# EAGLE design RoverPCB_version_4.2 (EAGLE 9.6.2)

## Sheet 1 of 2
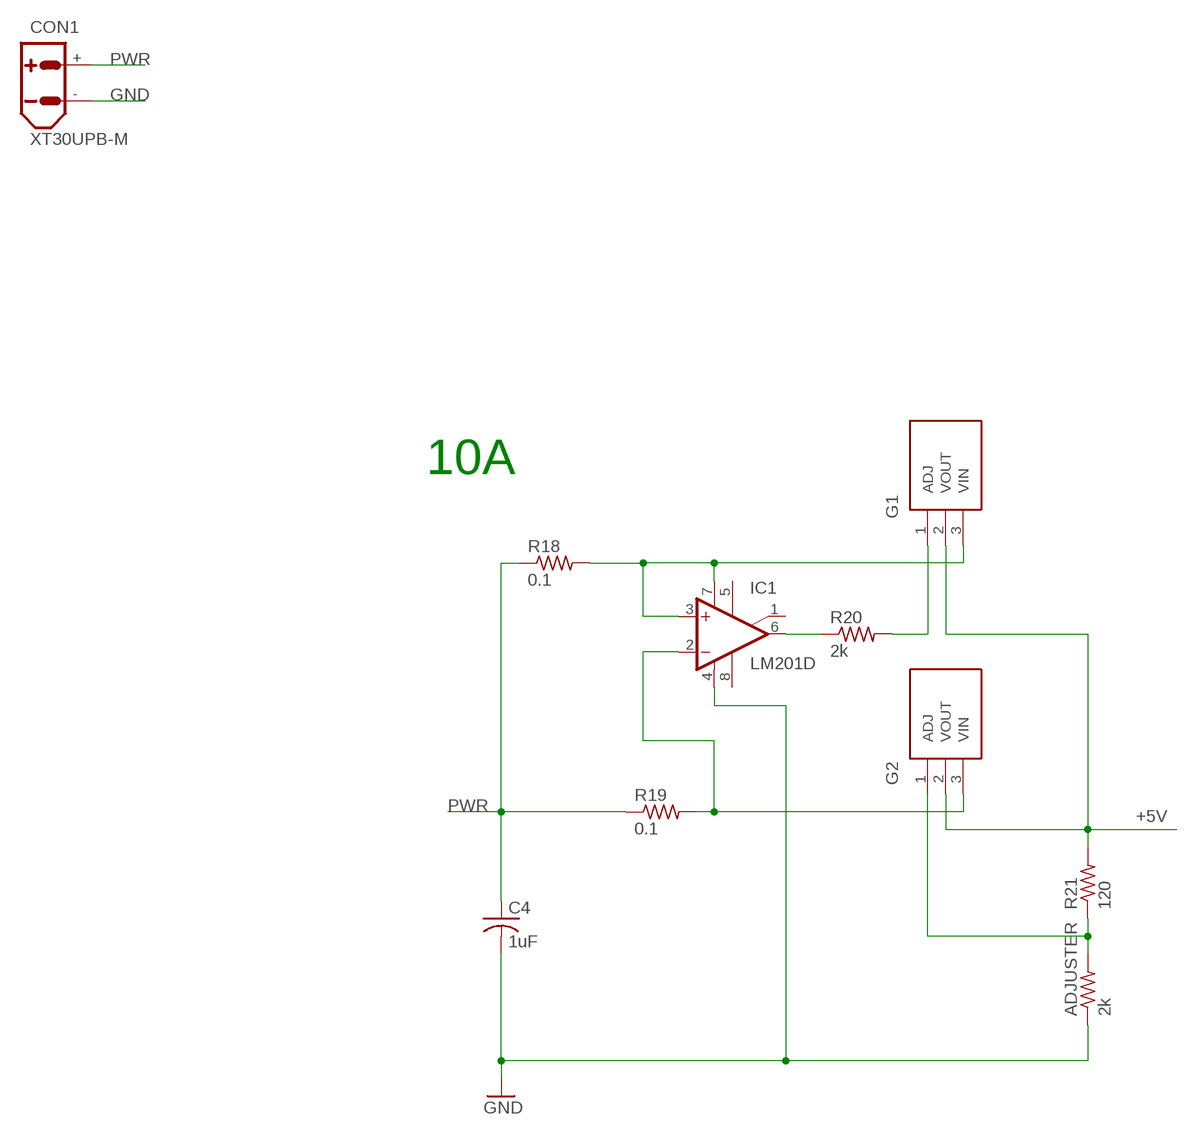
[diagram p0: schematic, sheet 1]

### Parts
ADJUSTER  2k  R-US_0204/5  [0204/5]
C4  1uF  C-USC0402K  [C0402K]
CON1  XT30UPB-M  [XT30UPB-M]
IC1  LM201D  [SO08]
IC11  G1  LM338T_NOPB  [TO254P470X1028X1955-3P]
IC12  G2  LM338T_NOPB  [TO254P470X1028X1955-3P]
R18  0.1  R-US_M1206  [M1206]
R19  0.1  R-US_M1206  [M1206]
R20  2k  R-US_R0805  [R0805]
R21  120  R-US_R0805  [R0805]

### Nets
+5V: IC11.2(VOUT) IC12.2(VOUT) R21.2 ; also sheet 2
GND: ADJUSTER.1 C4.2 CON1.- IC1.4(V-) ; also sheet 2
N$2: IC11.1(ADJ) R20.2
N$3: IC1.6(OUT) R20.1
N$4: ADJUSTER.2 IC12.1(ADJ) R21.1
N$20: IC1.3(+IN) IC1.7(V+) IC11.3(VIN) R18.2
N$23: IC1.2(-IN) IC12.3(VIN) R19.2
PWR: C4.1 CON1.+ R18.1 R19.1 ; also sheet 2
Unconnected: IC1.1(ON/CMP) IC1.5(ON) IC1.8(CMP)

### Notes on the sheet
- 10A

## Sheet 2 of 2
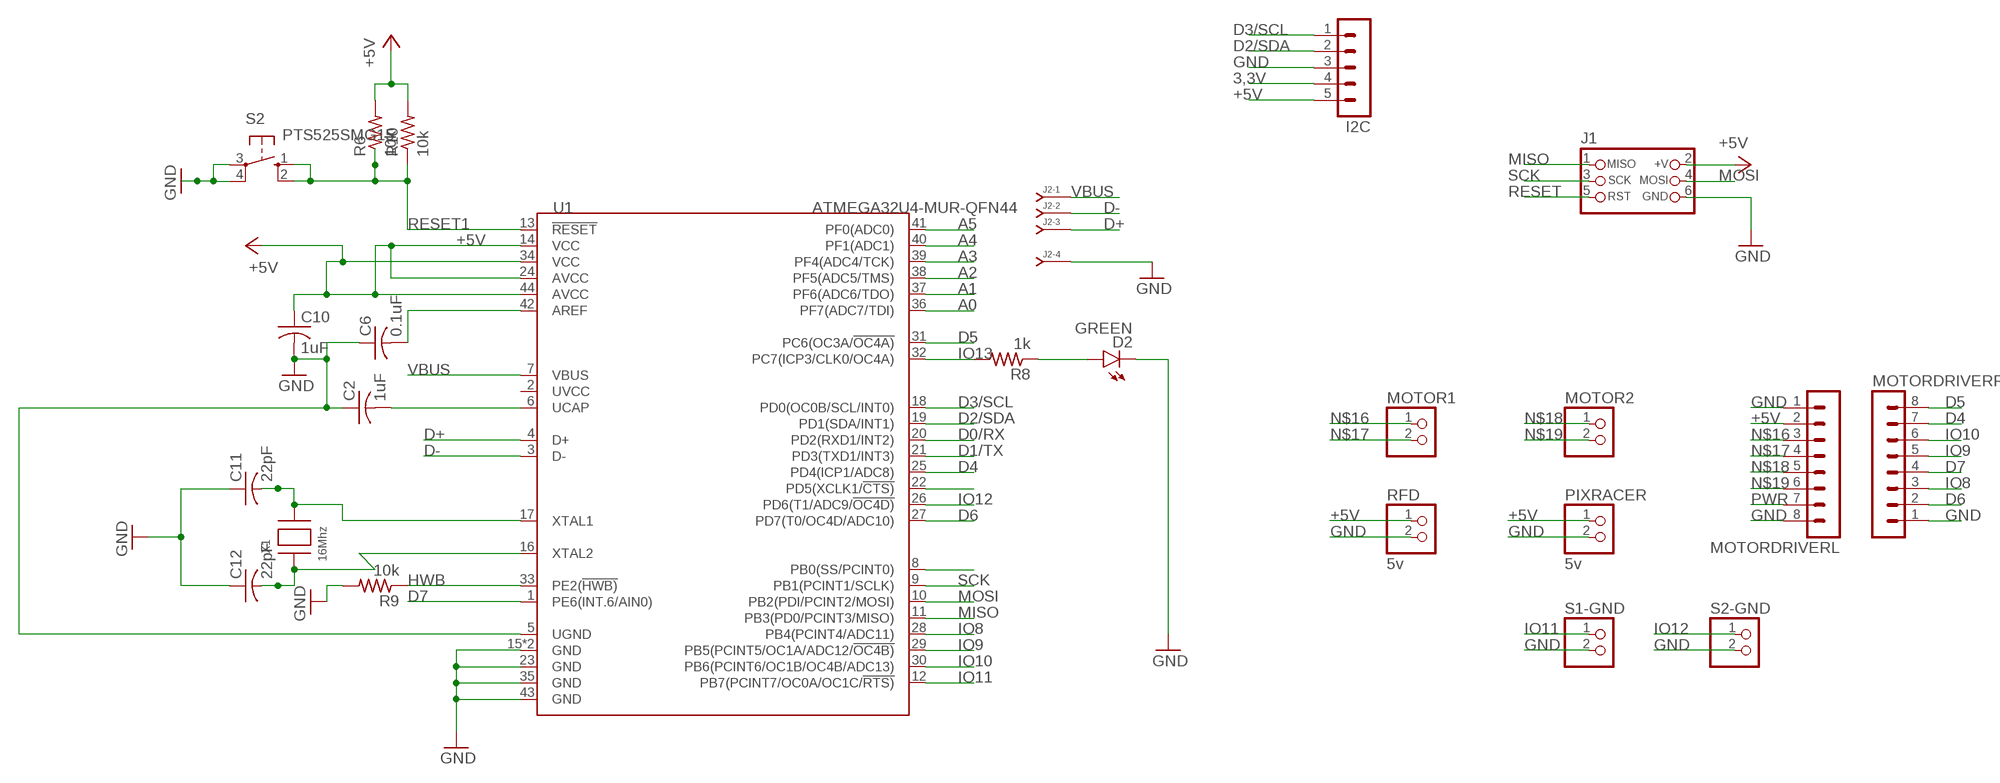
[diagram p1: schematic, sheet 2]

### Parts
C2  1uF  C-USC0805  [C0805]
C6  0.1uF  C-USC0805  [C0805]
C10  1uF  C-USC0805  [C0805]
C11  22pF  C-USC0805  [C0805]
C12  22pF  C-USC0805  [C0805]
D2  GREEN  LED-GREEN0603  [LED-0603]
I2C  MA05-1  [MA05-1]
J1  CON_HEADER_PRG_AVR_ICSP-PTH  [HEADER_PRG_2X03]
J2  J-04-SIP-100  [SIP-100-04]
MOTOR1  PINHD-1X2  [1X02]
MOTOR2  PINHD-1X2  [1X02]
MOTORDRIVERL  MA08-1  [MA08-1]
MOTORDRIVERR  MA08-1  [MA08-1]
PIXRACER  5v  PINHD-1X2  [1X02]
R6  10k  R-US_R0805  [R0805]
R8  1k  R-US_R0805  [R0805]
R9  10k  R-US_R0805  [R0805]
R10  10k  R-US_R0805  [R0805]
RFD  5v  PINHD-1X2  [1X02]
S1-GND  PINHD-1X2  [1X02]
S2  PTS525SMG15  [SMG15]
S2-GND  PINHD-1X2  [1X02]
U1  ATMEGA32U4-MUR-QFN44  MCU-ATMEGA32U4-MUR(VQFN44)  [QFN44G-0.5-7X7MM]
X1  16Mhz  XTALNX5032  [NX5032]

### Nets
3,3V: I2C.4
+5V: C10.1 I2C.5 J1.2(+V) MOTORDRIVERL.2 PIXRACER.1 R6.2 R10.2 RFD.1 U1.14(VCC) U1.24(AVCC) U1.34(VCC) U1.44(AVCC) ; also sheet 1
A0: U1.36(PF7(ADC7/TDI))
A1: U1.37(PF6(ADC6/TDO))
A2: U1.38(PF5(ADC5/TMS))
A3: U1.39(PF4(ADC4/TCK))
A4: U1.40(PF1(ADC1))
A5: U1.41(PF0(ADC0))
D0/RX: U1.20(PD2(RXD1/INT2))
D1/TX: U1.21(PD3(TXD1/INT3))
D2/SDA: I2C.2 U1.19(PD1(SDA/INT1))
D3/SCL: I2C.1 U1.18(PD0(OC0B/SCL/INT0))
D4: MOTORDRIVERR.7 U1.25(PD4(ICP1/ADC8))
D5: MOTORDRIVERR.8 U1.31(PC6(OC3A/!OC4A))
D6: MOTORDRIVERR.2 U1.27(PD7(T0/OC4D/ADC10))
D7: MOTORDRIVERR.4 U1.1(PE6(INT.6/AIN0))
D+: J2.3 U1.4(D+)
D-: J2.2 U1.3(D-)
GND: C2.1 C6.1 C10.2 C11.1 C12.1 D2.C I2C.3 J1.6(GND) J2.4 MOTORDRIVERL.1 MOTORDRIVERL.8 MOTORDRIVERR.1 PIXRACER.2 R9.2 RFD.2 S1-GND.2 S2-GND.2 S2.3(P) S2.4(P) U1.5(UGND) U1.15(GND) U1.23(GND) U1.35(GND) U1.43(GND) U1.TAB(GND) ; also sheet 1
HWB: R9.1 U1.33(PE2(!HWB))
IO8: MOTORDRIVERR.3 U1.28(PB4(PCINT4/ADC11))
IO9: MOTORDRIVERR.5 U1.29(PB5(PCINT5/OC1A/ADC12/!OC4B))
IO10: MOTORDRIVERR.6 U1.30(PB6(PCINT6/OC1B/OC4B/ADC13))
IO11: S1-GND.1 U1.12(PB7(PCINT7/OC0A/OC1C/!RTS))
IO12: S2-GND.1 U1.26(PD6(T1/ADC9/!OC4D))
IO13: R8.2 U1.32(PC7(ICP3/CLK0/OC4A))
MISO: J1.1(MISO) U1.11(PB3(PD0/PCINT3/MISO))
MOSI: J1.4(MOSI) U1.10(PB2(PDI/PCINT2/MOSI))
N$1: D2.A R8.1
N$6: C11.2 U1.17(XTAL1) X1.P$2
N$8: C2.2 U1.6(UCAP)
N$9: C12.2 U1.16(XTAL2) X1.P$1
N$10: C6.2 U1.42(AREF)
N$16: MOTOR1.1 MOTORDRIVERL.3
N$17: MOTOR1.2 MOTORDRIVERL.4
N$18: MOTOR2.1 MOTORDRIVERL.5
N$19: MOTOR2.2 MOTORDRIVERL.6
N$21: U1.22(PD5(XCLK1/!CTS))
N$24: U1.8(PB0(SS/PCINT0))
PWR: MOTORDRIVERL.7 ; also sheet 1
RESET: J1.5(RST)
RESET1: R6.1 R10.1 S2.1(S) S2.2(S) U1.13(!RESET)
SCK: J1.3(SCK) U1.9(PB1(PCINT1/SCLK))
VBUS: J2.1 U1.7(VBUS)
Unconnected: S2.S1(S) S2.S2(S) U1.2(UVCC)

## Library data of the parts
ADJUSTER R6 R10 R18-R21 = adafruit:R-US_: RESISTOR, American symbol
C2 C4 C6 C10-C12 = adafruit:C-US: CAPACITOR, American symbol
CON1 = amass:XT30: AMASS XT30 connector Store in Japan AMASS XT30 connector <https://szc.jp/ams-xt30>
D2 = SparkFun-LED:LED-GREEN: Various green LEDs Green LEDs used in SFE Production 0603- DIO-00821 LARGE- DIO-00862 LILYPAD- DIO-09910; PROD_ID: DIO-00821
I2C = con-lstb:MA05-1: PIN HEADER; OC_FARNELL: unknown; OC_NEWARK: unknown
IC1 = linear:LM201: OP AMP
IC11 IC12 = LM338T_NOPB:LM338T_NOPB: 5 Amp Adjustable Regulator LM338T LM338T/NOPB, Voltage Regulator, 5A Adjustable 1.2 32 V, 25W, 3-Pin TO-220 Source: Datasheet <http://www.ti.com/lit/ds/symlink/lm338.pdf>; ARROW_PART_NUMBER: LM338T/NOPB; ARROW_PRICE-STOCK: https://www.arrow.com/en/products/lm338tnopb/texas-instruments; DESCRIPTION: 5 Amp Adjustable Regulator LM338T LM338T/NOPB, Voltage Regulator, 5A Adjustable 1.2 32 V, 25W, 3-Pin TO-220; HEIGHT: 4.7mm; MANUFACTURER_NAME: Texas Instruments; MANUFACTURER_PART_NUMBER: LM338T/NOPB; MOUSER_PART_NUMBER: 926-LM338T/NOPB; MOUSER_PRICE-STOCK: https://www.mouser.co.uk/ProductDetail/Texas-Instruments/LM338T-NOPB?qs=X1J7HmVL2ZENaH7%2FMvkSlw%3D%3D
J1 = dp_devices:CON_HEADER_PRG_AVR_ICSP: 2x3 AVR ICSP programming header
J2 = con-headers-jp:J-04-: HEADER JACK PINS
MOTOR1 MOTOR2 S1-GND S2-GND = pinhead:PINHD-1X2: PIN HEADER
MOTORDRIVERL MOTORDRIVERR = con-lstb:MA08-1: PIN HEADER; OC_FARNELL: unknown; OC_NEWARK: unknown
PIXRACER RFD = pinhead:PINHD-1X2: PIN HEADER; SPICEPREFIX: R
R8 R9 = adafruit:R-US_: RESISTOR, American symbol; SPICEPREFIX: R
S2 = pts525_20:PTS525*G15: PTS 525 Series Miniature Tact Switch for SMD Source: http://www.ck-components.com/14407/pts525_8sept14.pdf/; MF: C&K Components; MPN: PTS525SMG15SMTR2LFS; OC_FARNELL: unknown; OC_NEWARK: unknown
U1 = Seeed-IC-2016:MCU-ATMEGA32U4-MUR(VQFN44): 310010016; MPN: ATMEGA32U4-MUR
X1 = adafruit:XTAL: Low cost SMT crystals, no capacitors included http://www.ladyada.net/library/eagle

## Board
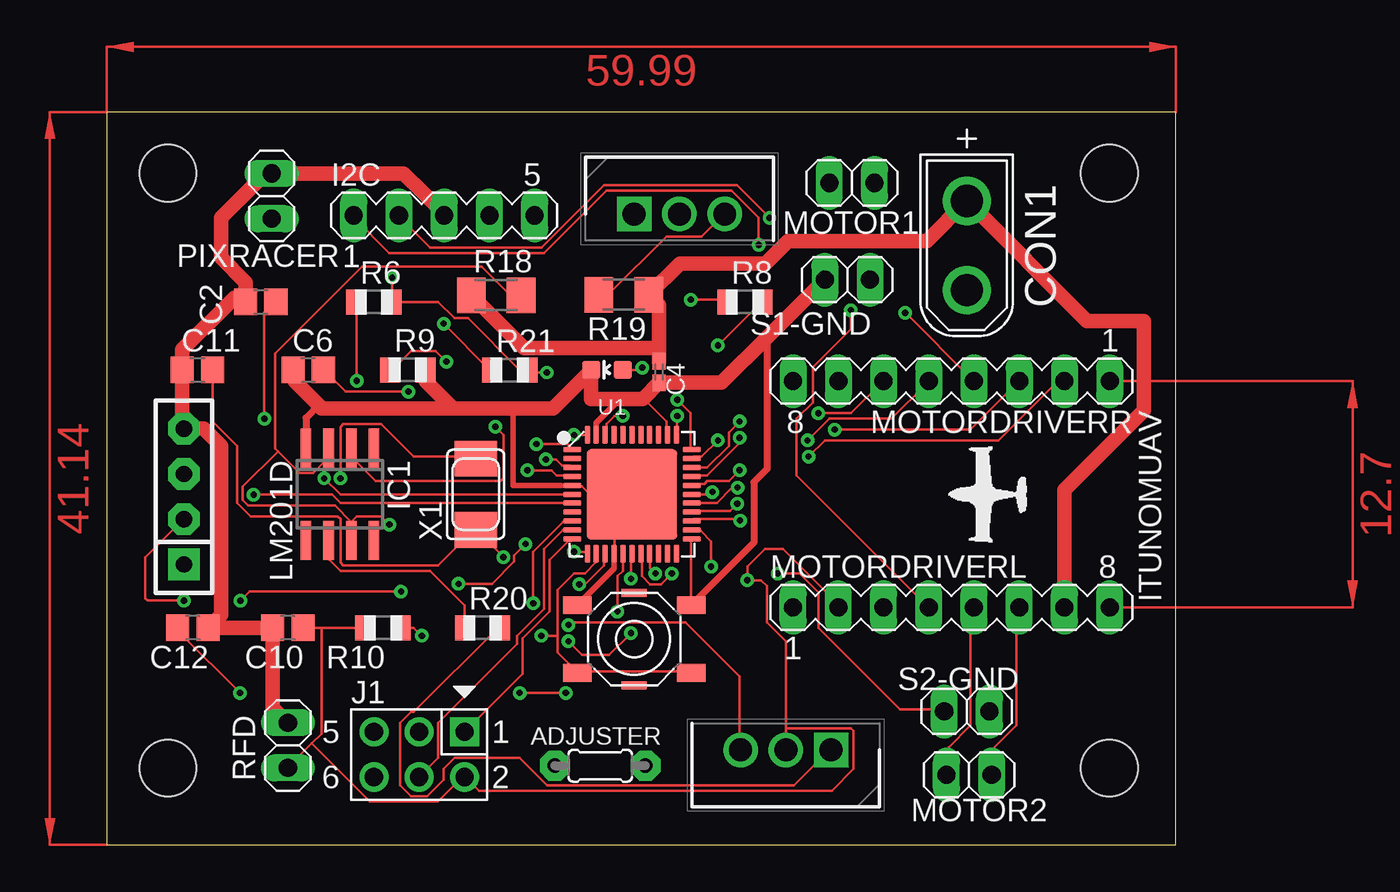
[diagram p2: board, top side]
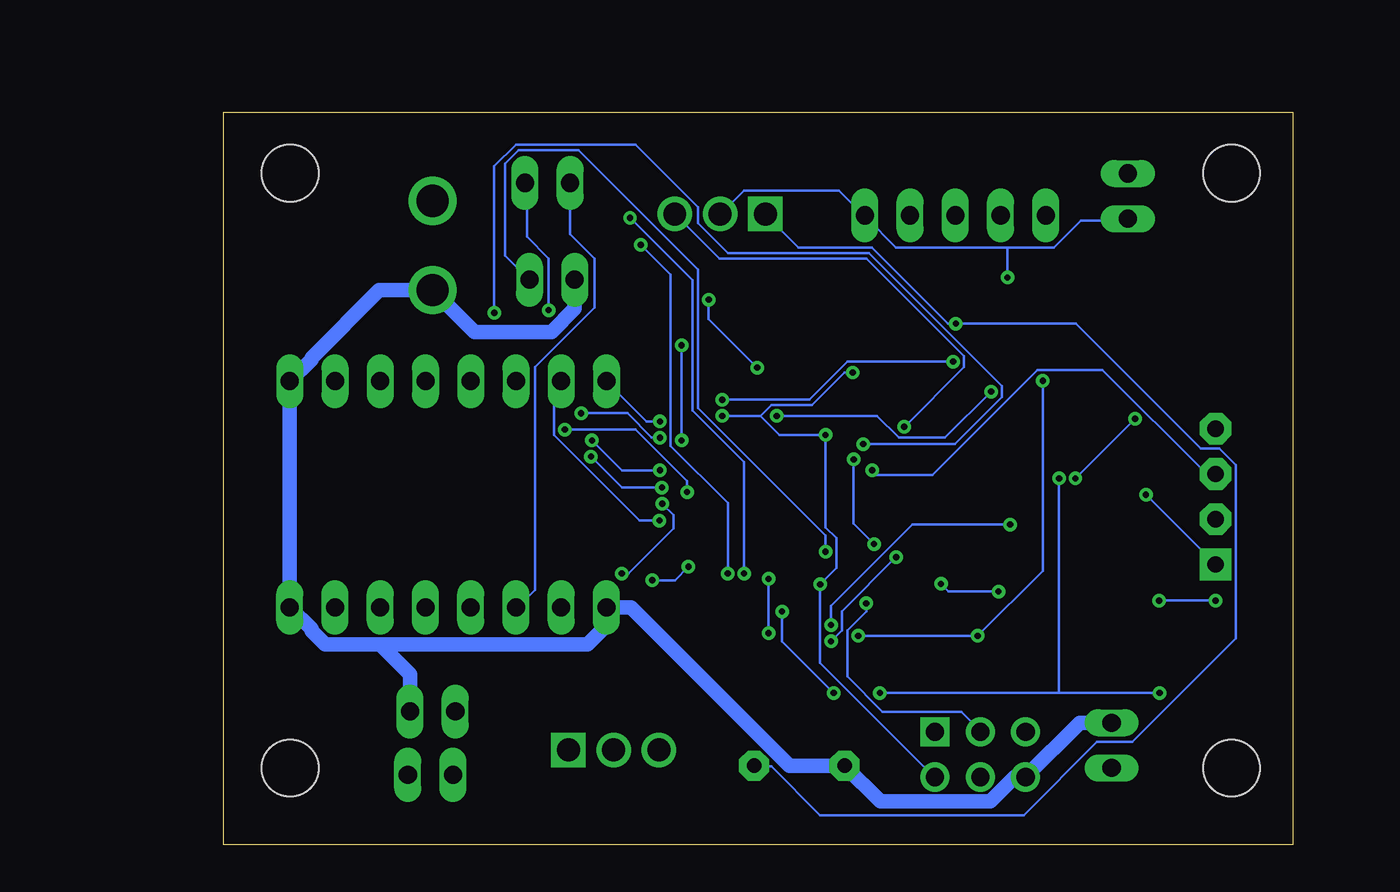
[diagram p3: board, bottom side, seen from below]

Size 59.99 x 41.14 mm. Coordinates in mm from the lower left corner, seen from the top.
Outline: 0,0 59.99,0 59.99,41.14 0,41.14 0,0
Copper layers (1*16): Top 0.035mm / dielectric 1.5mm / Bottom 0.035mm
Design rules "default": minimum track width 6mil, minimum drill 0.35mm, track to track 6mil, track to pad 6mil, pad to pad 6mil, via to via 6mil, smd to smd 6mil, copper to edge 40mil, drill to drill 6mil, minimum pad ring 10mil, minimum via ring 8mil, stop-mask expansion 4mil, vias tented up to drill 0mil, thermal gap 10mil
Holes 3.2 mm at 3.43,37.72 3.43,4.32 56.26,4.32 56.26,37.72

### Footprints (pad centres in the part's own frame; a part is rotated, then mirrored left to right if it is on the bottom)
0204/5 = drill 0.813 pad 1.676 octagon: 1 -2.54,0; 2 2.54,0
C0805 = smd 1.3 x 1.5: 1 -0.85,0; 2 0.85,0
C0402K = smd 0.925 x 0.74: 1 -0.6,0; 2 0.6,0
XT30UPB-M = drill 1.8: + 2.5,0; - -2.5,0
LED-0603 = smd 1 x 1: A 0,-0.877; C 0,0.877
MA05-1 = drill 1.016 long: 1 -5.08,0; 2 -2.54,0; 3 0,0; 4 2.54,0; 5 5.08,0
SO08 = smd 0.6 x 2.2: 1 -1.905,-2.6; 2 -0.635,-2.6; 3 0.635,-2.6; 4 1.905,-2.6; 5 1.905,2.6; 6 0.635,2.6; 7 -0.635,2.6; 8 -1.905,2.6
TO254P470X1028X1955-3P = drill 1.29 pad 1.935 square: 1 0,0 | drill 1.29 pad 1.935: 2 2.54,0; 3 5.08,0
HEADER_PRG_2X03 = drill 1.02 pad 1.632 square: 1 -2.54,-1.27 | drill 1.02 pad 1.632: 2 -2.54,1.27; 3 0,-1.27; 4 0,1.27; 5 2.54,-1.27; 6 2.54,1.27
SIP-100-04 = drill 0.914 pad 1.778 square: 1 -3.81,0 | drill 0.914 pad 1.778 octagon: 2 -1.27,0; 3 1.27,0; 4 3.81,0
1X02 = drill 1.016 long: 1 -1.27,0; 2 1.27,0
MA08-1 = drill 1.016 long: 1 -8.89,0; 2 -6.35,0; 3 -3.81,0; 4 -1.27,0; 5 1.27,0; 6 3.81,0; 7 6.35,0; 8 8.89,0
R0805 = smd 1.1 x 1.4: 1 -1,0; 2 1,0
M1206 = smd 1.6 x 2: 1 -1.4,0; 2 1.4,0
SMG15 = smd 1.6 x 1: 1 -3.2,1.9; 2 3.2,1.9; 3 -3.2,-1.9; 4 3.2,-1.9 | smd 1.4 x 0.45: S1 0,2.6; S2 0,-2.6
QFN44G-0.5-7X7MM = smd 1 x 0.3: 1 -3.35,2.5; 2 -3.35,2; 3 -3.35,1.5; 4 -3.35,1; 5 -3.35,0.5; 6 -3.35,0; 7 -3.35,-0.5; 8 -3.35,-1; 9 -3.35,-1.5; 10 -3.35,-2; 11 -3.35,-2.5; 23 3.35,-2.5; 24 3.35,-2; 25 3.35,-1.5; 26 3.35,-1; 27 3.35,-0.5; 28 3.35,0; 29 3.35,0.5; 30 3.35,1; 31 3.35,1.5; 32 3.35,2; 33 3.35,2.5 | smd 0.3 x 1: 12 -2.5,-3.35; 13 -2,-3.35; 14 -1.5,-3.35; 15 -1,-3.35; 16 -0.5,-3.35; 17 0,-3.35; 18 0.5,-3.35; 19 1,-3.35; 20 1.5,-3.35; 21 2,-3.35; 22 2.5,-3.35; 34 2.5,3.35; 35 2,3.35; 36 1.5,3.35; 37 1,3.35; 38 0.5,3.35; 39 0,3.35; 40 -0.5,3.35; 41 -1,3.35; 42 -1.5,3.35; 43 -2,3.35; 44 -2.5,3.35 | smd 5.08 x 5.08: TAB 0,0
NX5032 = smd 2 x 2.4: P$1 2,0; P$2 -2,0

### Placement (x,y rotation side)
ADJUSTER  27.69,4.45 0 top
C2  8.64,30.48 0 top
C4  30.99,26.54 270 top
C6  11.3,26.67 0 top
C10  10.16,12.19 180 top
C11  5.08,26.67 0 top
C12  4.83,12.19 180 top
CON1  48.26,33.66 90 top
D2  28.07,26.67 90 top
I2C  18.93,35.34 0 top
IC1  13.08,19.68 180 top
IC11  40.64,5.33 180 top
IC12  29.59,35.41 0 top
J1  17.53,5.08 180 top
J2  4.32,19.56 90 top
MOTOR1  41.81,37.16 0 top
MOTOR2  48.39,3.94 0 top
MOTORDRIVERL  47.4,13.34 0 top
MOTORDRIVERR  47.4,26.04 180 top
PIXRACER  9.25,36.42 90 top
R6  14.99,30.48 0 top
R8  35.81,30.48 0 top
R9  16.89,26.67 0 top
R10  15.49,12.19 180 top
R18  21.84,30.86 0 top
R19  29.01,30.89 180 top
R20  21.08,12.19 0 top
R21  22.61,26.64 0 top
RFD  10.16,5.59 90 top
S1-GND  41.56,31.73 180 top
S2  29.59,11.56 180 top
S2-GND  48.26,7.49 0 top
U1  29.46,19.68 0 top
X1  20.7,19.68 90 top

### Tracks (layer width: path | path; a pad name or v marks a point on that pad's centre or on a via)
+5V  (via drill 0.35)
  Top 0.152: 16,30.48 18.59,30.48 19.51,29.57 20.27,29.57 23.16,26.67 23.47,26.67 R21.2 23.62,26.52 v24.69,26.52 | v16,31.85 16,30.48 | 16,30.48 R6.2 | 32.92,17.68 U1.24 32.88,17.62 33.33,17.62 33.91,17.04 v33.91,15.62 | MOTORDRIVERL.2 41.15,13.41 37.95,16.61 36.93,16.61 35.94,15.62 v35.94,14.86 | 38.1,6.55 38.1,11.43 37.03,12.5 37.03,14.53 36.7,14.86 v35.94,14.86 | 38.1,6.55 IC11.2 | C10.1 12.04,12.19 | 12.04,12.19 R10.2 | 12.04,12.19 12.04,6.25 11.49,5.7 | 11.49,5.7 10.21,4.42 RFD.1 | v26.52,14.63 26.82,14.63 27.89,15.7 27.89,16.31 U1.14 | v26.21,23.01 26.82,23.01 U1.44 | v32,24.08 32,23.16 U1.34 | 11.49,5.7 14.76,2.44 18.59,2.44 19.96,3.81 J1.2 20.12,3.81 20.88,3.05 40.69,3.05 41.91,4.27 41.91,6.4 41.76,6.55 38.1,6.55 | v35.94,14.86 36.2,14.86
  Bottom 0.152: 16,33.53 22.25,33.53 23.93,35.2 I2C.5 24.08,35.36 25.45,36.73 30.79,36.73 32,35.51 IC12.2 | 16,33.53 13.41,33.53 11.89,35.05 9.3,35.05 PIXRACER.1 | 16,33.53 v16,31.85 | J1.2 20.12,3.81 26.52,10.21 v26.52,14.63 25.6,15.54 25.6,17.22 26.21,17.83 v26.21,23.01 28.8,23.01 29.87,24.08 | 29.87,24.08 v32,24.08 | v24.69,26.52 25.15,26.52 26.98,24.69 29.26,24.69 29.87,24.08 | v33.91,15.62 34.67,14.86 v35.94,14.86
D2/SDA  (via drill 0.35)
  Top 0.152: v30.79,15.24 30.48,15.54 30.48,16.31 U1.19 | v37.19,35.2 35.36,37.03 27.89,37.03 24.38,33.53 18.14,33.53 16.46,35.2 I2C.2
  Bottom 0.152: v30.79,15.24 30.79,21.49 33.68,24.38 33.68,31.7 v37.19,35.2
D3/SCL  (via drill 0.35)
  Top 0.152: v31.7,15.24 31.09,14.63 30.48,14.63 30.02,15.09 30.02,16.31 U1.18 | v36.58,33.68 36.58,35.2 35.05,36.73 28.04,36.73 24.54,33.22 15.85,33.22 13.87,35.2 I2C.1
  Bottom 0.152: v31.7,15.24 31.7,19.2 34.9,22.4 34.9,32 v36.58,33.68
D4  (via drill 0.35)
  Top 0.152: v35.53,18.21 35.41,18.21 35.33,18.29 32.92,18.29 U1.25
  Bottom 0.152: v35.53,18.21 36.65,18.21 41.45,23.01 41.45,25.6 41.15,25.91 MOTORDRIVERR.7
D5  (via drill 0.35)
  Top 0.152: v35.51,23.77 34.9,23.16 34.9,22.4 33.68,21.18 32.92,21.18 U1.31
  Bottom 0.152: v35.51,23.77 36.27,23.77 38.41,25.91 MOTORDRIVERR.8
D6  (via drill 0.35)
  Top 0.152: v35.4,20.06 35.09,20.06 34.24,19.2 32.83,19.2 U1.27 | v39.38,21.8 40.29,22.71 50.04,22.71 53.37,26.04 MOTORDRIVERR.2
  Bottom 0.152: v35.4,20.06 37.64,20.06 v39.38,21.8
D7  (via drill 0.35)
  Top 0.152: v24.11,22.5 25.85,22.5 U1.1 | v44.81,29.87 48.62,26.06 MOTORDRIVERR.4
  Bottom 0.152: v24.11,22.5 18.95,22.5 16.31,25.15 16.31,25.76 23.77,33.22 31.7,33.22 33.38,34.9 33.38,35.81 36.88,39.32 43.59,39.32 44.81,38.1 v44.81,29.87
D+  (via drill 0.35)
  Top 0.152: v23.6,21.03 24.94,21.03 25.25,20.73 26.06,20.73 U1.4
  Bottom 0.152: v23.6,21.03 23.34,20.78 20.22,20.78 14.33,26.67 10.67,26.67 4.88,20.88 4.42,20.88 J2.3
D-  (via drill 0.35)
  Top 0.152: U1.3 25.99,21.31 25.54,21.31 25.21,21.64 v24.64,21.64 | v23.5,16.89 22.86,16.25 22.86,15.9 21.61,14.65 v19.73,14.65 | v16.51,14.22 8,14.22 v7.49,13.72 | v4.32,13.72 2.29,13.72 2.16,13.84 2.16,16.13 J2.2
  Bottom 0.152: v24.64,21.64 24.64,18.03 v23.5,16.89 | v19.73,14.65 19.3,14.22 v16.51,14.22 | v7.49,13.72 v4.32,13.72
GND
  Top 0.152: 28.5,18.75 28.5,16.46 U1.15 | 28.5,18.75 29.41,19.66 U1.TAB 28.5,18.75 | 25.48,20.18 25.6,20.12 26.06,20.12 U1.5 26.21,20.12 26.67,20.12 28.04,18.75 28.5,18.75 | 10.54,26.04 10.52,26.36 10.52,26.67 C6.1 | 30.11,25.06 31.39,23.77 31.39,23.16 U1.35 | IC1.4 11.28,22.4 11.28,22.71 11.18,22.86 | S2.3 32.79,17.16 U1.23
  Top 0.305: 22.79,24.51 22.79,20.18 25.48,20.18 | U1.43 27.46,23.68 28.8,25.02 | U1.15 28.46,15.53 S2.4
  Top 0.406: 37.05,28.49 37.05,21.11 36.31,20.36 36.31,16.98 S2.3 33.08,13.74 | 11.89,24.69 11.18,23.98 11.18,22.86
  Top 0.813: RFD.2 9.31,7.71 C10.2 C12.1 6.4,12.92 6.4,22.4 5.43,23.37 J2.4 4.23,23.46 C11.1 4.23,27.8 7.16,30.73 7.53,30.73 C2.1 7.79,31.58 6.4,32.96 6.4,35.2 8.89,37.69 PIXRACER.2 16.66,37.69 17.71,36.65 17.71,36.64 18.93,35.42 I2C.3 | S1-GND.2 37.05,28.49 34.5,25.94 C4.2 30.11,25.06 30.06,25.02 28.8,25.02 27.18,25.02 27.18,26.66 D2.C 25.03,24.51 22.79,24.51 19.43,24.51 | 19.43,24.51 17.89,26.05 R9.2 | 19.43,24.51 12.06,24.51 11.89,24.69 10.54,26.04
  Bottom 0.813: 51.2,11.25 54.29,11.25 55.07,12.03 55.07,12.12 MOTORDRIVERL.8 MOTORDRIVERR.1 55.07,27.25 55.07,27.34 51.26,31.16 CON1.- 45.91,28.8 41.6,28.8 40.29,30.11 S1-GND.2 | 51.2,11.25 39.57,11.25 38.51,12.32 MOTORDRIVERL.1 37.14,13.34 28.25,4.45 ADJUSTER.1 23.14,2.44 16.96,2.44 15.58,3.81 J1.6 11.94,6.86 RFD.2 | 51.2,11.25 49.53,9.58 S2-GND.2
HWB  (via drill 0.35)
  Top 0.152: v32,24.99 32.77,24.23 32.77,22.25 U1.33 | v19.05,27.13 18.44,27.74 17.07,27.74 16,26.67 R9.1
  Bottom 0.152: v32,24.99 27.13,24.99 24.99,27.13 v19.05,27.13
IO8  (via drill 0.35)
  Top 0.152: v33.98,19.81 33.83,19.66 32.92,19.66 U1.28 | v40.84,23.32 48.46,23.32 51.05,25.91 MOTORDRIVERR.3
  Bottom 0.152: v33.98,19.81 33.98,20.42 36.88,23.32 v40.84,23.32
IO9  (via drill 0.35)
  Top 0.152: v35.51,21.03 34.9,20.42 33.68,20.42 33.53,20.27 32.92,20.27 U1.29 | v39.32,22.71 40.54,23.93 44.04,23.93 46.02,25.91 MOTORDRIVERR.5
  Bottom 0.152: v35.51,21.03 37.64,21.03 v39.32,22.71
IO10  (via drill 0.35)
  Top 0.152: v35.51,22.86 35.51,22.55 33.68,20.73 32.92,20.73 U1.30 | v39.93,24.23 41.76,24.23 43.43,25.91 MOTORDRIVERR.6
  Bottom 0.152: v35.51,22.86 35.97,22.86 37.34,24.23 v39.93,24.23
IO11  (via drill 0.35)
  Top 0.152: v26.21,16.46 26.82,16.46 U1.12
  Bottom 0.152: v26.21,16.46 26.21,17.37 33.38,24.54 33.38,32.31 40.08,39.01 43.43,39.01 44.2,38.25 44.2,33.07 42.98,31.85 S1-GND.1
IO12  (via drill 0.35)
  Top 0.152: v35.38,19.15 34.98,18.75 32.92,18.75 U1.26 | v37.64,15.24 38.86,15.24 39.93,14.17 39.93,12.19 44.5,7.62 46.94,7.62 S2-GND.1
  Bottom 0.152: v37.64,15.24 37.26,15.24 34.75,17.75 34.75,18.52 v35.38,19.15
IO13  (via drill 0.35)
  Top 0.152: v34.29,22.71 33.38,21.79 32.92,21.79 U1.32 | v34.29,28.04 36.73,30.48 R8.2
  Bottom 0.152: v34.29,28.04 v34.29,22.71
MISO
  Top 0.152: J1.1 23.32,9.6 23.32,11.58 24.84,13.11 24.84,16 25.91,17.07 26.06,17.07 U1.11
MOSI
  Top 0.152: J1.4 18.59,4.88 18.59,6.86 23.01,11.28 23.01,11.73 24.54,13.26 24.54,16.61 25.6,17.68 26.06,17.68 U1.10
N$1  (via drill 0.35)
  Top 0.152: D2.A 29.92,26.67 v30.05,26.8 | v32.77,30.61 34.69,30.61 R8.1
  Bottom 0.152: v30.05,26.8 32.77,29.52 v32.77,30.61
N$2
  Top 0.152: R20.2 21.95,12.19 17.22,7.47 17.07,7.47 16.46,6.86 16.46,3.35 17.07,2.74 17.98,2.74 18.9,3.66 18.9,4.27 19.51,4.88 23.16,4.88 24.69,3.35 38.56,3.35 40.54,5.33 IC11.1
N$3
  Top 0.152: R20.1 20.08,13.45 18.14,15.39 13.11,15.39 12.5,16 12.5,17.07 IC1.6
N$4  (via drill 0.35)
  Top 0.152: v18.9,29.26 21.49,26.67 R21.1
  Bottom 0.152: IC12.1 29.57,35.36 27.74,33.53 23.62,33.53 19.36,29.26 v18.9,29.26 12.17,29.26 5.16,22.25 4.12,22.25 3.2,21.34 3.2,11.58 8.99,5.79 10.97,5.79 15.09,1.68 26.52,1.68 29.26,4.42 30.18,4.42 ADJUSTER.2
N$6  (via drill 0.35)
  Top 0.152: v29.41,14.94 29.41,16.31 U1.17 | v29.41,11.89 28.19,10.67 26.67,10.67 v25.91,11.43 | v22.25,16.15 20.73,17.68 X1.P$2 20.57,17.68 18.59,15.7 13.26,15.7 13.11,15.85 13.11,18.29 12.95,18.44 8.08,18.44 7.32,19.2 7.32,22.4 5.94,23.77 5.94,26.67 C11.2
  Bottom 0.152: v29.41,11.89 v29.41,14.94 | v25.91,11.43 25.3,12.04 25.3,13.11 v22.25,16.15
N$8  (via drill 0.35)
  Top 0.152: v12.19,20.57 13.11,19.66 26.06,19.66 U1.6 | v8.84,23.93 8.84,29.87 9.45,30.48 C2.2
  Bottom 0.152: v8.84,23.93 v12.19,20.57
N$9  (via drill 0.35)
  Top 0.152: v28.65,13.11 28.65,15.09 28.96,15.39 28.96,16.31 U1.16 | v23.16,8.53 v25.76,8.53 | v7.47,8.53 4.12,11.89 4.12,12.19 C12.2 | v13.11,20.57 13.11,23.47 13.26,23.62 15.39,23.62 17.22,21.79 20.57,21.79 X1.P$1
  Bottom 0.152: v28.65,13.11 28.65,11.43 v25.76,8.53 | v7.47,8.53 13.11,8.53 | 13.11,8.53 v23.16,8.53 | 13.11,8.53 v13.11,20.57
N$10  (via drill 0.35)
  Top 0.152: v28.96,24.08 28.5,24.08 28.04,23.62 28.04,23.16 U1.42 | v16.92,25.45 13.41,25.45 12.19,26.67 C6.2
  Bottom 0.152: v28.96,24.08 23.32,24.08 22.1,22.86 19.51,22.86 v16.92,25.45
N$16
  Bottom 0.152: MOTOR1.1 40.54,37.03 40.54,34.29 39.17,32.92 39.17,30.18 42.52,26.82 42.52,14.33 43.43,13.41 MOTORDRIVERL.3
N$17  (via drill 0.35)
  Top 0.152: v41.76,30.02 41.76,28.96 39.62,26.82 39.62,24.84 38.71,23.93 38.71,20.73 46.02,13.41 MOTORDRIVERL.4
  Bottom 0.152: v41.76,30.02 41.76,32.92 42.98,34.14 42.98,37.03 MOTOR1.2
N$18
  Top 0.152: MOTOR2.1 47.24,3.96 47.24,5.49 48.46,6.71 48.46,13.11 48.62,13.26 MOTORDRIVERL.5
N$19
  Top 0.152: MOTOR2.2 49.68,3.96 49.68,5.33 51.05,6.71 51.05,13.26 MOTORDRIVERL.6
N$20  (via drill 0.35)
  Top 0.152: 9.6,22.1 10.82,20.88 11.58,20.88 12.34,21.64 12.34,22.25 IC1.3 | 9.6,22.1 9.45,22.25 9.45,27.58 14.33,32.46 21.03,32.46 22.55,30.94 23.16,30.94 R18.2 | 13.72,18.14 12.8,19.05 7.92,19.05 7.62,19.36 7.62,20.12 9.6,22.1 | v25.91,12.34 26.06,12.5 32.46,12.5 35.51,9.45 35.51,5.33 IC11.3 | v15.85,17.98 15.39,18.44 14.02,18.44 13.72,18.14 | 13.72,18.14 IC1.7
  Bottom 0.152: v25.91,12.34 25.91,13.41 21.34,17.98 v15.85,17.98
N$23  (via drill 0.35)
  Top 0.152: R19.2 27.74,30.94 28.19,30.94 31.39,34.14 33.38,34.14 34.59,35.36 IC12.3 | IC1.2 13.72,21.79 15.09,20.42 22.1,20.42 22.25,20.57 22.25,23.01 v21.79,23.47
  Bottom 0.152: v21.79,23.47 18.44,26.82 18.44,27.43 23.93,32.92 32.16,32.92 34.59,35.36 IC12.3
PWR
  Top 0.813: MOTORDRIVERL.7 53.75,19.91 58.21,24.38 58.21,29.42 55,29.42 CON1.+ 46.01,33.91 38.23,33.91 36.96,32.64 32.16,32.64 R19.1 30.99,30.3 C4.1 30.99,27.9 23.4,27.9 R18.1
RESET1  (via drill 0.35)
  Top 0.152: 25.3,11.73 25.3,10.82 26.36,9.75 S2.2 26.52,9.75 32.77,9.75 S2.1 | 25.3,11.73 25.3,14.33 26.21,15.24 26.82,15.24 27.43,15.85 27.43,16.31 U1.13 | R10.1 17.22,12.19 v17.68,11.73 | 25.3,11.73 v24.38,11.73 | v14.02,26.06 14.02,30.48 R6.1
  Bottom 0.152: v24.38,11.73 v17.68,11.73 14.02,15.39 v14.02,26.06
SCK  (via drill 0.35)
  Top 0.152: v23.93,13.56 23.93,16.46 25.6,18.14 26.06,18.14 U1.9
  Bottom 0.152: v23.93,13.56 23.93,13.11 24.99,12.04 24.99,9.45 23.01,7.47 18.59,7.47 17.53,6.4 J1.3
VBUS  (via drill 0.35)
  Top 0.152: v8.23,19.66 12.65,19.66 13.11,19.2 26.06,19.2 U1.7
  Bottom 0.152: J2.1 v8.23,19.66
(copper drawn outside any net)
  shapes: Top area x3

### Text on the board
tNames: ITUNOMUAV